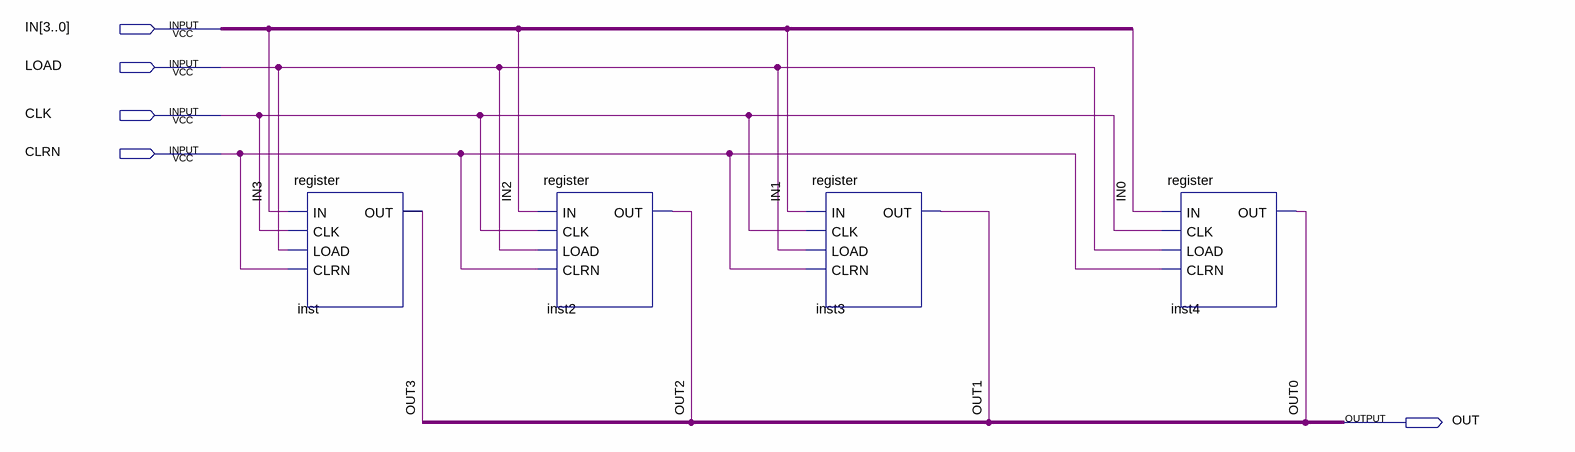
[diagram p0: schematic sheet]
// Quartus schematic reg4b.bdf as structural Verilog: 4 symbols, 5 pins
module reg4b (
  input  [3:0] IN,
  input  LOAD,
  input  CLK,
  input  CLRN,
  output OUT
);

  wire OUT0, OUT1, OUT2, OUT3;

  register inst (.IN(IN[3]), .CLK(CLK), .LOAD(LOAD), .CLRN(CLRN), .OUT(OUT3));
  register inst2 (.IN(IN[2]), .CLK(CLK), .LOAD(LOAD), .CLRN(CLRN), .OUT(OUT2));
  register inst3 (.IN(IN[1]), .CLK(CLK), .LOAD(LOAD), .CLRN(CLRN), .OUT(OUT1));
  register inst4 (.IN(IN[0]), .CLK(CLK), .LOAD(LOAD), .CLRN(CLRN), .OUT(OUT0));
endmodule
